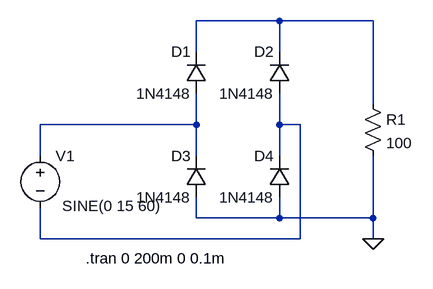
[diagram p0: schematic retificador_em_ponte.asc]
retificador_em_ponte.asc, the LTspice schematic file:
Version 4
SHEET 1 880 680
WIRE 256 -624 128 -624
WIRE 400 -624 256 -624
WIRE 128 -576 128 -624
WIRE 256 -576 256 -624
WIRE 400 -496 400 -624
WIRE 128 -464 128 -512
WIRE 128 -464 -112 -464
WIRE 256 -464 256 -512
WIRE 288 -464 256 -464
WIRE -112 -416 -112 -464
WIRE 128 -416 128 -464
WIRE 256 -416 256 -464
WIRE 128 -320 128 -352
WIRE 256 -320 256 -352
WIRE 256 -320 128 -320
WIRE 400 -320 400 -416
WIRE 400 -320 256 -320
WIRE -112 -288 -112 -336
WIRE 288 -288 288 -464
WIRE 288 -288 -112 -288
WIRE 400 -288 400 -320
FLAG 400 -288 0
SYMBOL diode 144 -512 R180
WINDOW 0 24 64 Left 2
WINDOW 3 24 0 Left 2
SYMATTR InstName D1
SYMATTR Value 1N4148
SYMBOL diode 272 -512 R180
WINDOW 0 24 64 Left 2
WINDOW 3 24 0 Left 2
SYMATTR InstName D2
SYMATTR Value 1N4148
SYMBOL diode 144 -352 R180
WINDOW 0 24 64 Left 2
WINDOW 3 24 0 Left 2
SYMATTR InstName D3
SYMATTR Value 1N4148
SYMBOL diode 272 -352 R180
WINDOW 0 24 64 Left 2
WINDOW 3 24 0 Left 2
SYMATTR InstName D4
SYMATTR Value 1N4148
SYMBOL voltage -112 -432 R0
WINDOW 3 34 93 Left 2
WINDOW 123 0 0 Left 0
WINDOW 39 0 0 Left 0
SYMATTR InstName V1
SYMATTR Value SINE(0 15 60)
SYMBOL res 384 -512 R0
SYMATTR InstName R1
SYMATTR Value 100
TEXT -42 -258 Left 2 !.tran 0 200m 0 0.1m

The netlist it stands for:
* retificador_em_ponte.asc
D1 N002 N001 1N4148
D2 N003 N001 1N4148
D3 0 N002 1N4148
D4 0 N003 1N4148
V1 N002 N003 SINE(0 15 60)
R1 N001 0 100
.model D D
.lib standard.dio
.tran 0 200m 0 0.1m
.backanno
.end